# EAGLE schematic lpc (EAGLE 6.5.0)
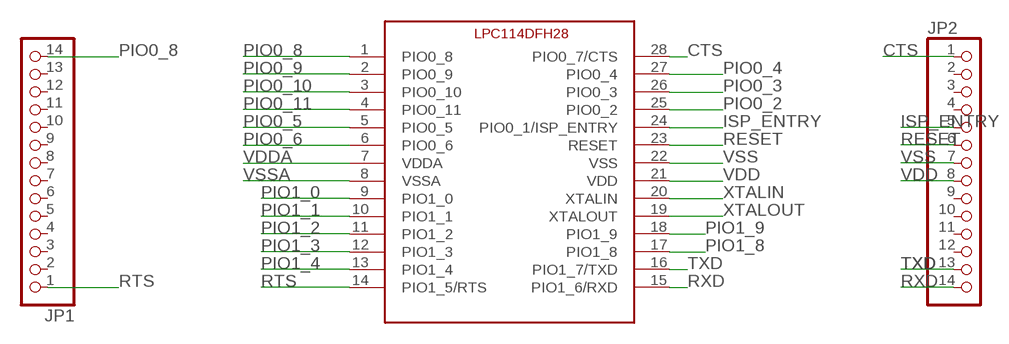
[diagram p0: schematic, sheet 1]

## Parts
JP1  PINHD-1X14-CB  [1X14-CB]
JP2  PINHD-1X14-CB  [1X14-CB]
U$1  MUC-LPC1114  [MUC-LPC1114]

## Nets
CTS: JP2.1 U$1.28(PIO0_7/CTS)
ISP_ENTRY: JP2.5 U$1.24(PIO0_1/ISP_ENTRY)
PIO0_2: U$1.25(PIO0_2)
PIO0_3: U$1.26(PIO0_3)
PIO0_4: U$1.27(PIO0_4)
PIO0_5: U$1.5(PIO0_5)
PIO0_6: U$1.6(PIO0_6)
PIO0_8: JP1.14 U$1.1(PIO0_8)
PIO0_9: U$1.2(PIO0_9)
PIO0_10: U$1.3(PIO0_10)
PIO0_11: U$1.4(PIO0_11)
PIO1_0: U$1.9(PIO1_0)
PIO1_1: U$1.10(PIO1_1)
PIO1_2: U$1.11(PIO1_2)
PIO1_3: U$1.12(PIO1_3)
PIO1_4: U$1.13(PIO1_4)
PIO1_8: U$1.17(PIO1_8)
PIO1_9: U$1.18(PIO1_9)
RESET: JP2.6 U$1.23(RESET)
RTS: JP1.1 U$1.14(PIO1_5/RTS)
RXD: JP2.14 U$1.15(PIO1_6/RXD)
TXD: JP2.13 U$1.16(PIO1_7/TXD)
VDD: JP2.8 U$1.21(VDD)
VDDA: U$1.7(VDDA)
VSS: JP2.7 U$1.22(VSS)
VSSA: U$1.8(VSSA)
XTALIN: U$1.20(XTALIN)
XTALOUT: U$1.19(XTALOUT)
Unconnected: JP1.2 JP1.3 JP1.4 JP1.5 JP1.6 JP1.7 JP1.8 JP1.9 JP1.10 JP1.11 JP1.12 JP1.13 JP2.2 JP2.3 JP2.4 JP2.9 JP2.10 JP2.11 JP2.12

## Library data of the parts
JP1 JP2 = adafruit:PINHD-1X14: PIN HEADER
U$1 = gclue:MUC-LPC1114